# Altium schematic sheet 12V Rail.SchDoc
size A4; SheetNumber: 1; SheetTotal: 3
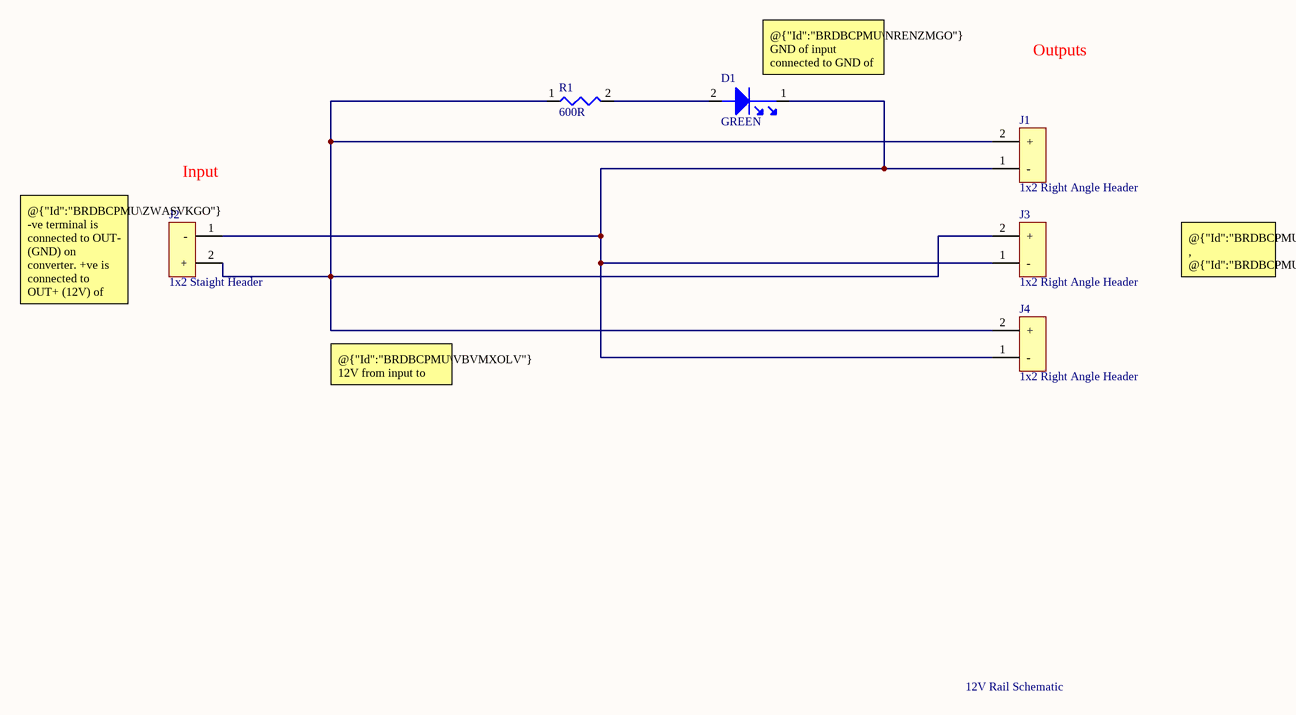
[diagram p0: 12V Rail.SchDoc]

## Parts
D1  GREEN  [LED]
J1  1x2 Right Angle Header  [39291028 Molex Output]
J2  1x2 Staight Header  [39281023 Molex Input]
J3  1x2 Right Angle Header  [39291028 Molex Output]
J4  1x2 Right Angle Header  [39291028 Molex Output]
R1  600R  [600R]

## Nets
NetD1_1: D1.1 J1.1(-) J2.1(-) J3.1(-) J4.1(-)
NetD1_2: D1.2 R1.2
NetJ1_2: J1.2(+) J2.2(+) J3.2(+) J4.2(+) R1.1

## Notes on the sheet
- (near D1) @{"Id":"BRDBCPMU\NRENZMGO"} GND of input connected to GND of outputs
- Outputs
- Input
- @{"Id":"BRDBCPMU\JTMSUHPC"} , @{"Id":"BRDBCPMU\JUETWFFF"} , @{"Id":"BRDBCPMU\JHVOWNPX"} +ve is 12V
  -ve is GND
- @{"Id":"BRDBCPMU\ZWASVKGO"} -ve terminal is connected to OUT- (GND) on converter. +ve is connected to OUT+ (12V) of converter
- @{"Id":"BRDBCPMU\VBVMXOLV"} 12V from input to outputs
- 12V Rail Schematic

## Library data of the parts
D1 = WP7113GT: Green T-1 3/4 5 mm 20° Tinted 80 mcd 2.2 V Solid State LED Lamp Through Hole; Manufacturer: Kingbright; Lens Color: Clear; Lens Style: Clear,Tinted,Dome; Luminous Intensity: 80mcd; Forward Voltage: 2.2V; Test Current: 20mA; Dominant Wavelength: 568nm; Supplier 1: Digi-Key; Manufacturer Part Number: WP7113GT; RoHS: Yes; Category: LEDs; Stock 1: 30029; Pricing 1: 1=0.38000, 10=0.25200, 100=0.16800, 500=0.11618, 1000=0.09682, 2000=0.08714, 5000=0.08230, 10000=0.07504, 25000=0.07019 (USD); Mount: Through Hole; Case/Package: Radial; Color: Green; Package Quantity: 1000; Viewing Angle: 20°; Packaging: Bulk; Illumination Color: Green; Wavelength: 568nm; Height: 8.6mm; Lead Free: Lead Free; RoHS Compliant: Yes; ComponentLink1URL: https://datasheet.ciiva.com/2120/wp7113gt-2120962.pdf?src-supplier=Digi-Key; ComponentLink1Description: https://datasheet.ciiva.com/2120/wp7113gt-2120962.pdf?src-supplier=Digi-Key; ComponentLink2URL: https://datasheet.ciiva.com/4692/wp7113gt-56132-4692472.pdf?src-supplier=Mouser; ComponentLink2Description: https://datasheet.ciiva.com/4692/wp7113gt-56132-4692472.pdf?src-supplier=Mouser; ComponentLink3URL: https://datasheet.ciiva.com/16510/wp7113gt-16510239.pdf?src-supplier=Future+Electronics; ComponentLink3Description: https://datasheet.ciiva.com/16510/wp7113gt-16510239.pdf?src-supplier=Future+Electronics; ComponentLink4URL: https://datasheet.ciiva.com/26292/wp7113gt-26292250.pdf?src-supplier=Digi-Key; ComponentLink4Description: https://datasheet.ciiva.com/26292/wp7113gt-26292250.pdf?src-supplier=Digi-Key; Supplier Part Number 1: 754-1731-ND
J1 J3 J4 = 39-29-1028: Connector Wire to Board Header 2 Position 4.2mm Solder Right Angle Thru-Hole Tray; Manufacturer: Molex; Gender: Male; Current Rating: 13A; Contact Resistance: 10mR; Voltage Rating: 600V; Number of Contacts: 2; Insulation Resistance: 1GR; Max Current Rating: 5A; Max Voltage Rating (DC): 250V; Row Spacing: 5.5mm; Approvals: UL,CSA,TUV; Glow Wire Compliant: Non-compliant; Supplier 1: Newark; Manufacturer Part Number: 39-29-1028; RoHS: Yes; Category: Headers and Wire Housings; Stock 1: 1062; Pricing 1: 1=1.17000, 10=0.95900, 25=0.90600, 50=0.85300, 100=0.80000, 250=0.77300 (CAD); Mount: Through Hole,Surface Mount; Contact Plating: Tin,Copper; Contact Material: Brass; Housing Material: Nylon; Color: Natural; Housing Color: Natural; Material: Brass; Contact Shape: Square; Contact Finish - Mating: TIN; Insulation Material: Nylon; Insulation Color: Natural; Min Operating Temperature: -40°C; Max Operating Temperature: 105°C; Termination: Solder; Packaging: Bulk; Orientation: Right Angle; Series: Mini-Fit Jr 5569; Number of Rows: 2; Contact Gender: Male; Package Quantity: 600; Connector Type: Header; Contact Type: Male Pin; Number of Positions: 2; Number of Circuits: 2; Voltage Rating (DC): 600V; Fastening Type: Ramp; Length: 15.4mm; Height: 9.91mm; Pitch: 4.2mm; Depth: 19.4mm; Radiation Hardening: No; Lead Free: Lead Free; RoHS Compliant: Yes; ELV: Compliant; Halogen Free: Low Halogen; Flammability Rating: UL94 V-2; ComponentLink1URL: https://datasheet.ciiva.com/5159/0039291028-pcb-headers-140068-5159558.pdf?src-supplier=Mouser; ComponentLink1Description: https://datasheet.ciiva.com/5159/0039291028-pcb-headers-140068-5159558.pdf?src-supplier=Mouser; ComponentLink2URL: https://datasheet.ciiva.com/34303/1968937-34303478.pdf?src-supplier=Jameco; ComponentLink2Description: https://datasheet.ciiva.com/34303/1968937-34303478.pdf?src-supplier=Jameco; ComponentLink3URL: https://datasheet.ciiva.com/11746/0900766b8059542f-11746930.pdf?src-supplier=RSComponents; ComponentLink3Description: https://datasheet.ciiva.com/11746/0900766b8059542f-11746930.pdf?src-supplier=RSComponents; ComponentLink4URL: https://datasheet.ciiva.com/9468/0039291028-pcb-headers-9468469.pdf?src-supplier=Avnet; ComponentLink4Description: https://datasheet.ciiva.com/9468/0039291028-pcb-headers-9468469.pdf?src-supplier=Avnet; ComponentLink5URL: https://datasheet.ciiva.com/1442/1859947-1442805.pdf?src-supplier=Element14; ComponentLink5Description: https://datasheet.ciiva.com/1442/1859947-1442805.pdf?src-supplier=Element14; Supplier Part Number 1: 79AH9848
J2 = 39-28-1023: Connector Wire to Board Header 2 Position 4.2mm Solder Straight Thru-Hole Tray; Manufacturer: Molex; Voltage Rating: 600V; Current Rating: 9A; Contact Resistance: 10mR; Number of Poles: 2; Gender: Male; Insulation Resistance: 1GR; Max Current Rating: 15A; Connector Type: Power,Rectangular; Working Voltage: 250V; Number of Ports: 1; Row Spacing: 0.165inch; Approvals: UL,CSA,TUV; Glow Wire Compliant: Non-compliant; Supplier 1: Newark; Manufacturer Part Number: 39-28-1023; RoHS: Yes; Category: Headers and Wire Housings; Stock 1: 7932; Pricing 1: 1=0.66300, 10=0.56200, 25=0.52000, 50=0.47800, 100=0.43700, 250=0.42600 (USD); Mount: Through Hole,Board; Contact Plating: Tin,Copper; Contact Material: Brass; Housing Material: Nylon; Color: Natural,Clear; Housing Color: Natural; Min Operating Temperature: -40°C; Max Operating Temperature: 105°C; Termination: Solder; Series: Mini-Fit® Jr™ 5566; Number of Rows: 2; Package Quantity: 1200; Packaging: Tray; Max Voltage Rating (DC): 600V; Number of Contacts: 2; Orientation: Straight; Voltage Rating (DC): 600V; Voltage Rating (AC): 600V; Contact Gender: Male; Number of Positions: 2; Number of Circuits: 2; Fastening Type: Ramp; Contact Type: Male Pin; Max Voltage Rating (AC): 600V; Length: 6.2mm; Height: 12mm; Pitch: 4.2mm; Depth: 11mm; Lead Pitch: 4.2mm; Radiation Hardening: No; Lead Free: Lead Free; RoHS Compliant: Yes; Halogen Free: Low Halogen; Flammability Rating: UL94 V-2; ComponentLink1URL: https://datasheet.ciiva.com/5157/0039281023-pcb-headers-228438-5157638.pdf?src-supplier=Mouser; ComponentLink1Description: https://datasheet.ciiva.com/5157/0039281023-pcb-headers-228438-5157638.pdf?src-supplier=Mouser; ComponentLink2URL: https://datasheet.ciiva.com/30094/32110039281023-pcb-headers-30094576.pdf?src-supplier=Onlinecomponents.com; ComponentLink2Description: https://datasheet.ciiva.com/30094/32110039281023-pcb-headers-30094576.pdf?src-supplier=Onlinecomponents.com; ComponentLink3URL: https://datasheet.ciiva.com/26921/getdatasheetpartid-293336-26921902.pdf?src-supplier=Verical; ComponentLink3Description: https://datasheet.ciiva.com/26921/getdatasheetpartid-293336-26921902.pdf?src-supplier=Verical; ComponentLink4URL: https://datasheet.ciiva.com/19462/1968742-19462127.pdf?src-supplier=Jameco; ComponentLink4Description: https://datasheet.ciiva.com/19462/1968742-19462127.pdf?src-supplier=Jameco; ComponentLink5URL: https://datasheet.ciiva.com/11746/0900766b80460d9e-11746456.pdf?src-supplier=RSComponents; ComponentLink5Description: https://datasheet.ciiva.com/11746/0900766b80460d9e-11746456.pdf?src-supplier=RSComponents; ComponentLink6URL: https://datasheet.ciiva.com/1442/1859939-1442781.pdf?src-supplier=Element14; ComponentLink6Description: https://datasheet.ciiva.com/1442/1859939-1442781.pdf?src-supplier=Element14; Supplier Part Number 1: 38C9737
R1 = MRS25000C6000FCT00: MRS25 Series Axial Thin Film Resistor 600Ohms +/-1% 0.6W +/-50ppm/degC; Manufacturer: Vishay; Tolerance: 1%; Power Rating: 600mW; Voltage Rating: 350V; Temperature Coefficient: 50ppm/°C; Lead Length: 26mm; Supplier 1: Newark; Manufacturer Part Number: MRS25000C6000FCT00; RoHS: Yes; Category: Through-Hole Resistors; Stock 1: 3212; Pricing 1: 10=0.29800, 25=0.24900, 50=0.19900, 100=0.15100, 500=0.11200 (CAD); Case/Package: Axial; Number of Pins: 2; Contact Plating: Tin; Min Operating Temperature: -55°C; Max Operating Temperature: 155°C; Resistance: 600R; Resistor Type: Metal Film; Packaging: Tape and Reel; Number of Terminations: 2; Termination: Axial; Max Power Dissipation: 600mW; Voltage Rating (DC): 350V; Series: MRS25; Resistance Tolerance: 1%; Construction: Cylindrical; Technology: THIN FILM; Diameter: 2.5mm; Length: 6.5mm; Width: 2.5mm; Radiation Hardening: No; Reach SVHC Compliant: Yes; Military Standard: Not; Lead Free: Lead Free; RoHS Compliant: Yes; ComponentLink1URL: https://datasheet.ciiva.com/11825/0900766b80d9a016-11825068.pdf?src-supplier=RSComponents; ComponentLink1Description: https://datasheet.ciiva.com/11825/0900766b80d9a016-11825068.pdf?src-supplier=RSComponents; ComponentLink2URL: https://datasheet.ciiva.com/46445/483924-46445563.pdf?src-supplier=Element14; ComponentLink2Description: https://datasheet.ciiva.com/46445/483924-46445563.pdf?src-supplier=Element14; Supplier Part Number 1: 97K5918